# EAGLE design Flasher (EAGLE 4.13)
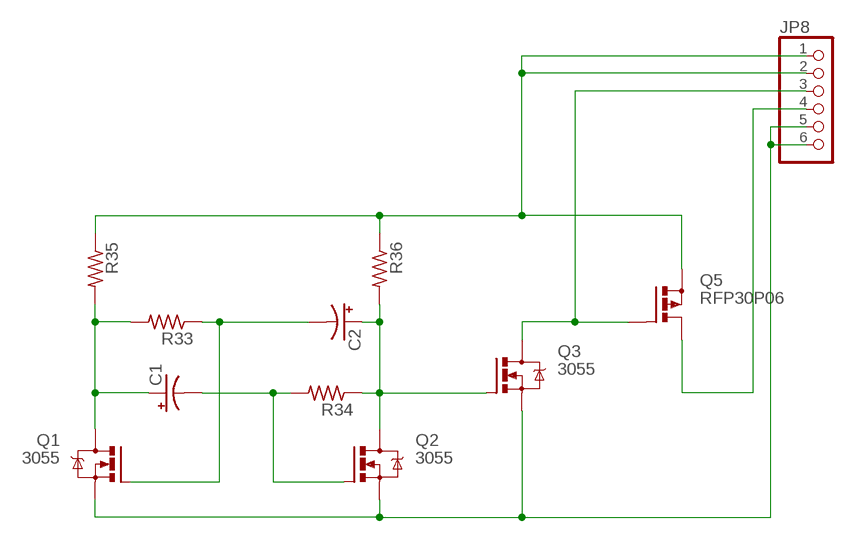
[diagram p0: schematic, sheet 1]

## Parts
C1  CPOL-USCT3528  [CT3528]
C2  CPOL-USCT3528  [CT3528]
JP8  PINHD-1X6  [1X06]
Q1  3055  MTP3055VSOIC  [SOT223R_INFINEON]
Q2  3055  MTP3055VSOIC  [SOT223R_INFINEON]
Q3  3055  MTP3055VSOIC  [SOT223R_INFINEON]
Q5  RFP30P06  PMOSFET_PTO220BV  [TO220BV]
R33  RESISITORR1206  [R1206]
R34  RESISITORR1206  [R1206]
R35  RESISITORR1206  [R1206]
R36  RESISITORR1206  [R1206]

## Nets
N$11: C1.+ Q1.2(D) R33.2 R35.2
N$12: C2.+ Q2.2(D) Q3.1(G) R34.1 R36.2
N$14: C2.- Q1.1(G) R33.1
N$15: C1.- Q2.1(G) R34.2
N$37: JP8.1 JP8.2 Q5.S R35.1 R36.1
N$41: JP8.4 Q5.D
N$42: JP8.3 Q3.2(D) Q5.G
N$44: JP8.5 JP8.6 Q1.3(S) Q2.3(S) Q3.3(S)

## Library data of the parts
C1 C2 = rcl:CPOL-US: POLARIZED CAPACITOR, American symbol
JP8 = pinhead:PINHD-1X6: PIN HEADER
Q1-Q3 = 1 Dan's Common Parts:MTP3055V: N-CHANNEL MOS FET
Q5 = 1 Dan's Common Parts:PMOSFET_P: Power MOSFET P-Channel
R33-R36 = 1 Dan's Common Parts:RESISITOR: RESISTOR, American symbol

## Board
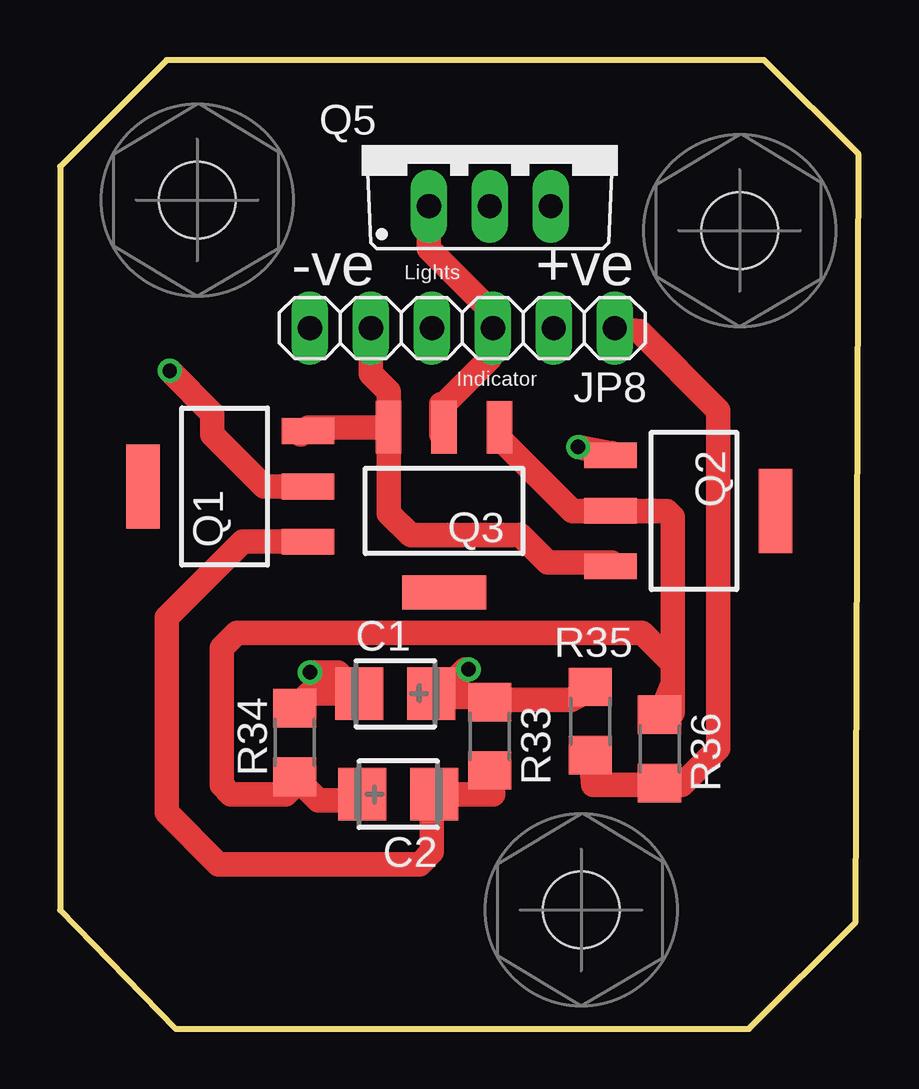
[diagram p1: board, top side]
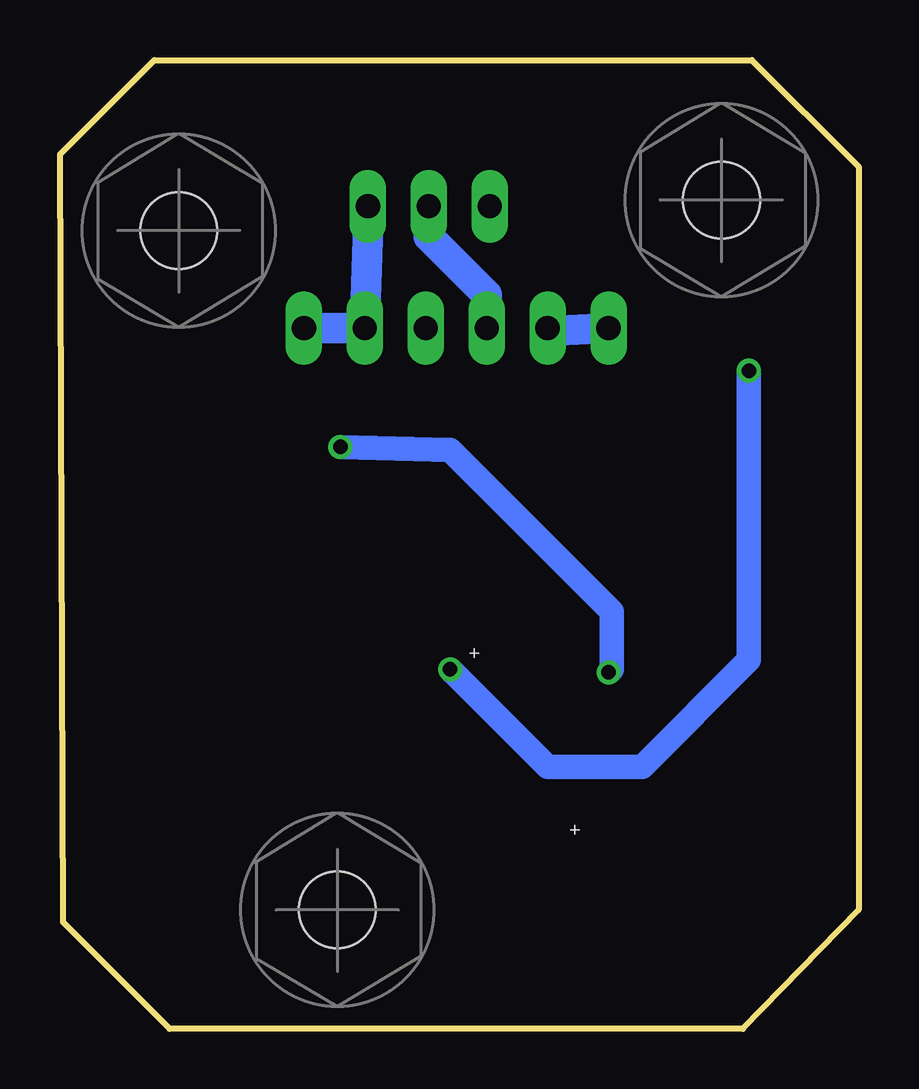
[diagram p2: board, bottom side, seen from below]

Size 33.27 x 40.39 mm. Coordinates in mm from the lower left corner, seen from the top.
Outline: 0,35.94 0,4.95 4.83,0 28.7,0 33.15,4.44 33.27,36.45 29.34,40.39 4.45,40.39 0,35.94
Copper layers (1*16): Top 0.035mm / dielectric 1.5mm / Bottom 0.035mm
Design rules "default": minimum track width 10mil, minimum drill 20mil, track to track 8mil, track to pad 8mil, pad to pad 8mil, via to via 8mil, smd to smd 8mil, copper to edge 40mil, drill to drill 8mil, minimum pad ring 10mil, minimum via ring 8mil, stop-mask expansion 4mil, vias tented up to drill 0mil, thermal gap 10mil

### Footprints (pad centres in the part's own frame; a part is rotated, then mirrored left to right if it is on the bottom)
CT3528 = smd 2 x 2.2: + 1.5,0; - -1.5,0
1X06 = drill 1.016 long: 1 -6.35,0; 2 -3.81,0; 3 -1.27,0; 4 1.27,0; 5 3.81,0; 6 6.35,0
SOT223R_INFINEON = smd 1.067 x 2.184: 1 -2.311,-3.479; 2 0,-3.48; 3 2.312,-3.48 | smd 3.5 x 1.4: 4 0,3.404
TO220BV = drill 1.016 long: D 0,-2.54; G -2.54,-2.54; S 2.54,-2.54
R1206 = smd 1.6 x 1.803: 1 -1.422,0; 2 1.422,0
SCREW = hole 3.2: 0,0

### Placement (x,y rotation side)
C1  13.97,13.97 0 top
C2  14.1,9.78 180 top
JP8  16.76,29.21 180 top
Q1  6.86,22.61 90 top
Q2  26.42,21.59 270 top
Q3  16,21.59 180 top
Q5  17.91,36.83 0 top
R33  17.91,12.19 90 top
R34  9.78,11.94 90 top
R35  22.1,12.83 90 top
R36  24.98,11.67 90 top
U$33  [SCREW]  28.32,33.27 0 top
U$38  [SCREW]  5.71,34.54 0 top
U$39  [SCREW]  21.72,4.95 0 top

### Tracks (layer width: path | path; a pad name or v marks a point on that pad's centre or on a via)
N$11  (via drill 0.6)
  Top 1.016: 21.31,13.72 21.84,13.97 | 21.31,13.72 R35.2 | 21.31,13.72 18.31,13.72 R33.2 18.39,13.84 15.98,13.84 C1.+ 15.47,13.87 15.62,13.72 16.89,14.99 v17.02,14.99 | Q1.2 8.51,22.61 6.35,24.77 6.35,25.65 v4.57,27.43
  Bottom 1.016: v4.57,27.43 4.57,15.37 9.02,10.92 12.95,10.92 v17.02,14.99
N$12
  Top 1.016: Q3.1 18.31,24.61 21.34,21.59 Q2.2 | Q2.2 22.99,21.59 | 25.53,14.4 R36.2 25.53,13.18 25.53,14.4 | 25.53,15.24 25.53,21.34 25.27,21.59 Q2.2 | Q2.2 | C2.+ 12.34,9.53 10.77,9.53 R34.1 9.78,10.16 9.4,9.78 7.11,9.78 6.73,10.16 6.73,15.88 7.37,16.51 24.26,16.51 25.53,15.24 | 25.53,15.24 25.53,14.4
N$14
  Top 1.016: R33.1 18.06,9.78 C2.- 15.49,9.68 15.49,7.37 14.99,6.86 6.6,6.86 4.45,9.02 4.45,17.14 7.62,20.32 10.36,20.32 | 10.67,20.32 10.36,20.32 | 10.36,20.32 Q1.1
N$15  (via drill 0.6)
  Top 1.016: R34.2 10.39,13.97 C1.- 11.58,14.86 v10.41,14.86 | Q2.1 22.99,23.95 22.99,24 22.86,24 v21.59,24.26
  Bottom 1.016: v10.41,14.86 10.29,14.99 10.29,17.4 17.02,24.13 v21.59,24.26
N$37
  Top 1.016: JP8.1 24.13,29.08 27.43,25.78 27.43,11.68 25.91,10.16 24.31,10.16 R36.1 24.13,10.16 22.23,10.16 R35.1
  Bottom 1.27: Q5.S 20.45,32.89 JP8.2 | JP8.2 20.45,28.7 | 23.24,29.08 JP8.1 JP8.2
N$41
  Bottom 1.27: Q5.D 17.91,33.02 15.49,30.61 15.49,29.34 15.37,29.21 JP8.4
N$42
  Top 1.016: 17.78,29.08 JP8.3 | 17.78,29.08 17.91,28.96 17.91,27.94 16,26.04 15.88,26.04 | Q5.G 15.37,32.51 17.78,30.1 17.78,29.08 | Q3.2 16,25.15 | 16,25.15 | 16,25.15 16,24.89 15.88,24.77 15.88,26.04 | 15.88,26.04
N$44
  Top 1.016: Q3.3 13.69,26.57 12.95,27.3 JP8.5 | 10.19,24.92 10.03,24.77 | 10.19,24.92 Q1.3 | Q3.3 10.34,25.07 10.19,24.92 | Q3.3 13.69,21.49 14.61,20.57 19.18,20.57 20.32,19.43 22.99,19.43 23.11,19.3 23.09,19.28 Q2.3
  Bottom 1.27: JP8.5 12.95,29.08 | 12.95,29.08 JP8.6 | 12.95,29.08 13.08,28.96

### Text on the board
tPlace: -ve | Lights | +ve | Indicator
bPlace: + | +